# Altium schematic sheet msp430f.SchDoc
size 355 x 203 mm
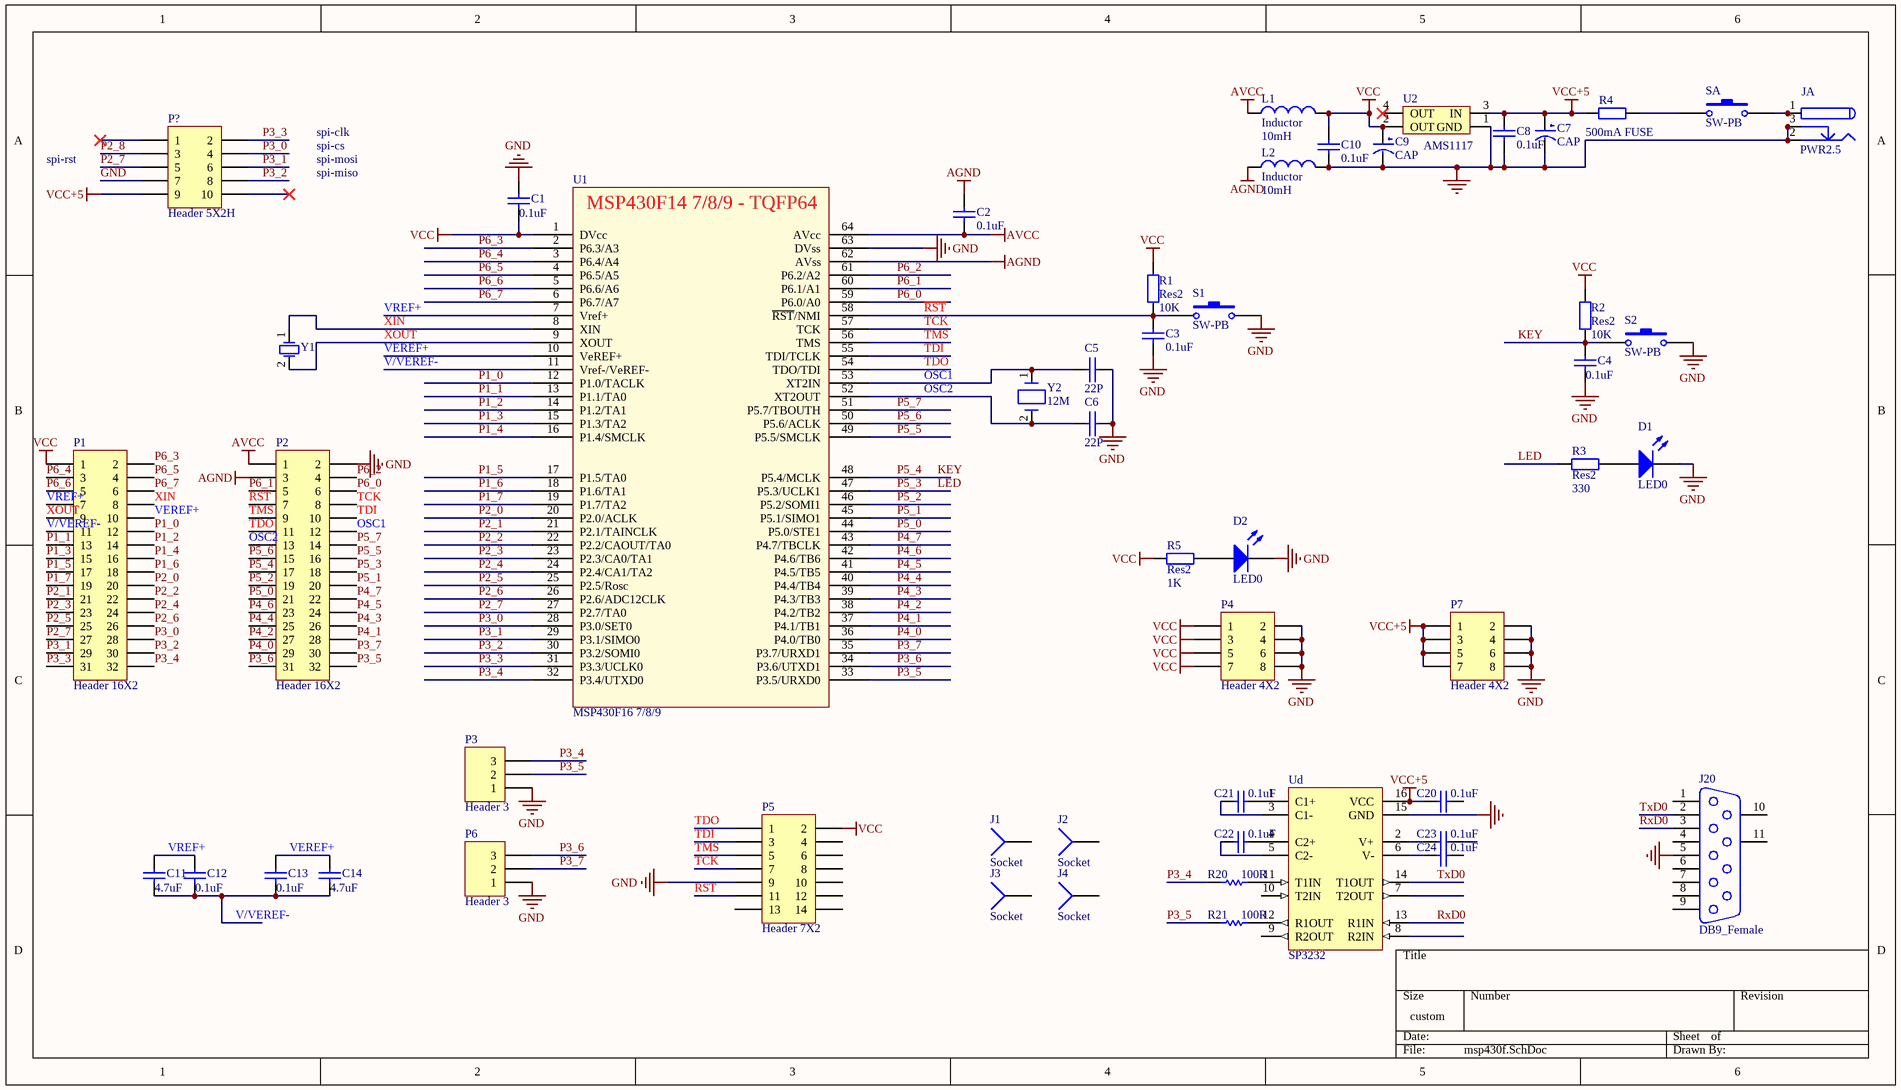
[diagram p0: msp430f.SchDoc]

## Parts
C1  value 0.1uF  [CAP_SMD_0805_2012_M]
C2  value 0.1uF  [CAP_SMD_0805_2012_M]
C3  value 0.1uF  [c0805]
C4  value 0.1uF  [CAP_SMD_0805_2012_M]
C5  22P  [CAP_SMD_0805_2012_M]
C6  22P  [CAP_SMD_0805_2012_M]
C7  CAP  [AEC_SMD_6.3*5.3_6.3*7.7_M]
C8  value 0.1uF  [CAP_SMD_0805_2012_M]
C9  CAP  [EC6.3X6.3]
C10  value 0.1uF  [CAP_SMD_0805_2012_M]
C11  value 4.7uF  [CAP_SMD_0805_2012_M]
C12  value 0.1uF  [CAP_SMD_0805_2012_M]
C13  value 0.1uF  [CAP_SMD_0805_2012_M]
C14  value 4.7uF  [CAP_SMD_0805_2012_M]
C20  0.1uF  [CAP_SMD_0805_2012_M]
C21  0.1uF  [CAP_SMD_0805_2012_M]
C22  0.1uF  [CAP_SMD_0805_2012_M]
C23  0.1uF  [CAP_SMD_0805_2012_M]
C24  0.1uF  [CAP_SMD_0805_2012_M]
D1  LED0  [LED_SMD_0805_2012_M]
D2  LED0  [LED_SMD_0805_2012_M]
J1  Socket  [Screw_3x6]
J2  Socket  [Screw_3x6]
J3  Socket  [Screw_3x6]
J4  Socket  [Screw_3x6]
J20  DB9_Female  [DSUB1.385-2H9]
JA  PWR2.5  [KLD-0202]
L1  Inductor  value 10mH  [RES_SMD_0805_2012_M]
L2  Inductor  value 10mH  [RES_SMD_0805_2012_M]
P1  Header 16X2  [HDR2X16]
P2  Header 16X2  [HDR2X16]
P3  Header 3  [HDR1X3]
P4  Header 4X2  [HDR2X4]
P5  Header 7X2  [HDR2X7]
P6  Header 3  [HDR1X3]
P7  Header 4X2  [HDR2X4]
P?  Header 5X2H  [HDR2X5H]
R1  Res2  value 10K  [RES_SMD_0805_2012_M]
R2  Res2  value 10K  [RES_SMD_0805_2012_M]
R3  Res2  value 330  [CAP_SMD_0805_2012_M]
R4  500mA FUSE  [1812]
R5  Res2  value 1K  [RES_SMD_0805_2012_M]
R20  100R  [RES_SMD_0805_2012_M]
R21  100R  [RES_SMD_0805_2012_M]
S1  SW-PB  [SW01]
S2  SW-PB  [SW01]
SA  SW-PB  [SPST-2]
U1  MSP430F16 7/8/9  [TQFP-64]
U2  AMS1117  [SOT230P700X180-4N]
Ud  SP3232  [SOIC-16N]
Y1  (no value)  [XTAL32]
Y2  12M  [XTAL_DIP_HC49US2_N]

## Nets
AGND: C2.2 L2.1 P2.3 U1.62(AVss)
AVCC: C2.1 L1.1 P2.1 U1.64(AVcc)
GND: C1.2 C3.1 C4.1 C5.1 C6.1 C7.2(GND) C8.1 C9.2(GND) C10.1 D1.2(K) D2.2(K) J20.5 JA.2 JA.2A JA.2B JA.3 JA.3A JA.3B L2.2 P2.2 P3.1 P4.2 P4.4 P4.6 P4.8 P5.9 P6.1 P7.2 P7.4 P7.6 P7.8 P?.7 S1.2 S2.2 U1.63(DVss) U2.1(GND) Ud.15(GND)
VCC: C1.1 C9.1(VCC) C10.2 L1.2 P1.1 P4.1 P4.3 P4.5 P4.7 P5.2 R1.2 R2.2 R5.2 U1.1(DVcc) U2.2(OUT)
VCC+5: C7.1(VCC) C8.2 C20.2 P7.1 P7.3 P7.5 P7.7 P?.9 R4.2 U2.3(IN) Ud.16(VCC)
KEY: C4.2 P2.17 R2.1 S2.1 U1.48(P5.4/MCLK)  [also labelled P5_4]
LED: P2.18 R3.1 U1.47(P5.3/UCLK1)  [also labelled P5_3]
OSC1: C5.2 P2.12 U1.53(XT2IN) Y2.1
OSC2: C6.2 P2.13 U1.52(XT2OUT) Y2.2
P1_0: P1.12 U1.12(P1.0/TACLK)
P1_1: P1.13 U1.13(P1.1/TA0)
P1_2: P1.14 U1.14(P1.2/TA1)
P1_3: P1.15 U1.15(P1.3/TA2)
P1_4: P1.16 U1.16(P1.4/SMCLK)
P1_5: P1.17 U1.17(P1.5/TA0)
P1_6: P1.18 U1.18(P1.6/TA1)
P1_7: P1.19 U1.19(P1.7/TA2)
P2_0: P1.20 U1.20(P2.0/ACLK)
P2_1: P1.21 U1.21(P2.1/TAINCLK)
P2_2: P1.22 U1.22(P2.2/CAOUT/TA0)
P2_3: P1.23 U1.23(P2.3/CA0/TA1)
P2_4: P1.24 U1.24(P2.4/CA1/TA2)
P2_5: P1.25 U1.25(P2.5/Rosc)
P2_6: P1.26 U1.26(P2.6/ADC12CLK)
P2_7: P1.27 P?.5 U1.27(P2.7/TA0)
P2_8: P?.3
P3_0: P1.28 P?.4 U1.28(P3.0/SET0)
P3_1: P1.29 P?.6 U1.29(P3.1/SIMO0)
P3_2: P1.30 P?.8 U1.30(P3.2/SOMI0)
P3_3: P1.31 P?.2 U1.31(P3.3/UCLK0)
P3_4: P1.32 P3.3 R20.2 U1.32(P3.4/UTXD0)
P3_5: P2.32 P3.2 R21.2 U1.33(P3.5/URXD0)
P3_6: P2.31 P6.3 U1.34(P3.6/UTXD1)
P3_7: P2.30 P6.2 U1.35(P3.7/URXD1)
P4_0: P2.29 U1.36(P4.0/TB0)
P4_1: P2.28 U1.37(P4.1/TB1)
P4_2: P2.27 U1.38(P4.2/TB2)
P4_3: P2.26 U1.39(P4.3/TB3)
P4_4: P2.25 U1.40(P4.4/TB4)
P4_5: P2.24 U1.41(P4.5/TB5)
P4_6: P2.23 U1.42(P4.6/TB6)
P4_7: P2.22 U1.43(P4.7/TBCLK)
P5_0: P2.21 U1.44(P5.0/STE1)
P5_1: P2.20 U1.45(P5.1/SIMO1)
P5_2: P2.19 U1.46(P5.2/SOMI1)
P5_5: P2.16 U1.49(P5.5/SMCLK)
P5_6: P2.15 U1.50(P5.6/ACLK)
P5_7: P2.14 U1.51(P5.7/TBOUTH)
P6_0: P2.6 U1.59(P6.0/A0)
P6_1: P2.5 U1.60(P6.1/A1)
P6_2: P2.4 U1.61(P6.2/A2)
P6_3: P1.2 U1.2(P6.3/A3)
P6_4: P1.3 U1.3(P6.4/A4)
P6_5: P1.4 U1.4(P6.5/A5)
P6_6: P1.5 U1.5(P6.6/A6)
P6_7: P1.6 U1.6(P6.7/A7)
~{RST}: C3.2 P2.7 P5.11 R1.1 S1.1 U1.58(~{RST}/NMI)
RxD0: J20.3 Ud.13(R1IN)
TCK: P2.8 P5.7 U1.57(TCK)
TDI: P2.10 P5.3 U1.55(TDI/TCLK)
TDO: P2.11 P5.1 U1.54(TDO/TDI)
TMS: P2.9 P5.5 U1.56(TMS)
TxD0: J20.2 Ud.14(T1OUT)
V/VEREF-: C11.1 C12.1 C13.1 C14.1 P1.11 U1.11(Vref-/VeREF-)
VEREF+: C13.2 C14.2 P1.10 U1.10(VeREF+)
VREF+: C11.2 C12.2 P1.7 U1.7(Vref+)
XIN: P1.8 U1.8(XIN) Y1.1(OSC1)
XOUT: P1.9 U1.9(XOUT) Y1.2(OSC2)
NetC21_1: C21.1 Ud.1(C1+)
NetC21_2: C21.2 Ud.3(C1-)
NetC22_1: C22.1 Ud.4(C2+)
NetC22_2: C22.2 Ud.5(C2-)
NetC23_2: C23.2 Ud.2(V+)
NetC24_2: C24.2 Ud.6(V-)
NetD1_1: D1.1(A) R3.2
NetD2_1: D2.1(A) R5.1
NetJA_1: JA.1 JA.1A JA.1B SA.2
NetR4_1: R4.1 SA.1
NetR20_1: R20.1 Ud.11(T1IN)
NetR21_1: R21.1 Ud.12(R1OUT)

Not connected (* = marked no-connect by the designer): C20 1; C23 1; C24 1; J1 1; J2 1; J3 1; J4 1; J20 1 4 6 7 8 9 10(MH1) 11(MH2); P5 4 6 8 10 12 13 14; P? 1* 10*; U2 4(OUT)*; Ud 7(T2OUT) 8(R2IN) 9(R2OUT) 10(T2IN)

## Notes on the sheet
- spi-rst
- spi-clk
- spi-cs
- spi-mosi
- spi-miso
- (in symbol MSP430F14 7/8/9) MSP430F14 7/8/9 - TQFP64

## Library data of the parts
C1-C4 C8 C10-C14 = Cap: Capacitor; Published: 8-Jun-2000; LatestRevisionDate: 17-Jul-2002; LatestRevisionNote: Re-released for DXP Platform.; PackageReference: RAD-0.3; Publisher: Altium Limited
C5 C6 = CAP: Value: 33pF
C20-C24 = C: C Capacity
D1 D2 = LED0: Typical INFRARED GaAs LED; Published: 8-Jun-2000; LatestRevisionDate: 08-Jul-2005; LatestRevisionNote: Mech Layer 1 removed.; PackageReference: LED-0; Publisher: Altium Limited
J20 = DB9: J Receptacle Assembly, 9 Position, Right Angle
JA = PWR2.5: Low Voltage Power Supply Connector; Published: 17-Dec-2003; DatasheetDocument: 09-May-2002; Publisher: Altium Limited; ComponentLink1Description: Manufacturer Link; ComponentLink1URL: http://domino.kycon.com/internet/Products.html
L1 L2 = Inductor: Code_IEC: 1005; Published: 8-Jun-2000; LatestRevisionDate: 17-Jul-2002; LatestRevisionNote: Re-released for DXP Platform.; PackageReference: 0402-A; Publisher: Altium Limited; Code_JEITA: 0402
P1 P2 = Header 16X2: Header, 16-Pin, Dual row; LatestRevisionDate: 17-Jul-2002; LatestRevisionNote: Re-released for DXP Platform.; Publisher: Altium Limited
P3 P6 = Header 3: Header, 3-Pin; LatestRevisionDate: 17-Jul-2002; LatestRevisionNote: Re-released for DXP Platform.; Publisher: Altium Limited
P4 P7 = Header 4X2: Header, 4-Pin, Dual row; LatestRevisionDate: 17-Jul-2002; LatestRevisionNote: Re-released for DXP Platform.; Publisher: Altium Limited
P5 = Header 7X2: Header, 7-Pin, Dual row; LatestRevisionDate: 17-Jul-2002; LatestRevisionNote: Re-released for DXP Platform.; Publisher: Altium Limited
P? = Header 5X2H: Header, 5-Pin, Dual row, Right Angle; LatestRevisionDate: 17-Jul-2002; LatestRevisionNote: Re-released for DXP Platform.; Publisher: Altium Limited
R1-R5 = Res2: Resistor; Published: 8-Jun-2000; LatestRevisionDate: 17-Jul-2002; LatestRevisionNote: Re-released for DXP Platform.; PackageReference: AXIAL-0.4; Publisher: Altium Limited
R20 R21 = R: R Resistor
S1 S2 SA = SW-PB: Switch; Published: 24-Mar-1999; LatestRevisionDate: 17-Jul-2002; LatestRevisionNote: Re-released for DXP Platform.; PackageReference: SPST-2; Publisher: Altium Limited
  SA: PackageDescription: Switch; 2 Leads
U1 = MSP430F14 7/8/9
Ud = MAX3232: U +3.3V Powered RS-232 Driver/Receiver
Y1 = XTAL: Crystal Oscillator; Published: *; LatestRevisionDate: *; LatestRevisionNote: *; Publisher: *
Y2 = CRYSTAL
J1-J4 = Socket: LatestRevisionDate: 17-Jul-2002; LatestRevisionNote: Re-released for DXP Platform.; Publisher: Altium Limited